# Altium schematic sheet RF.SchDoc
size A3
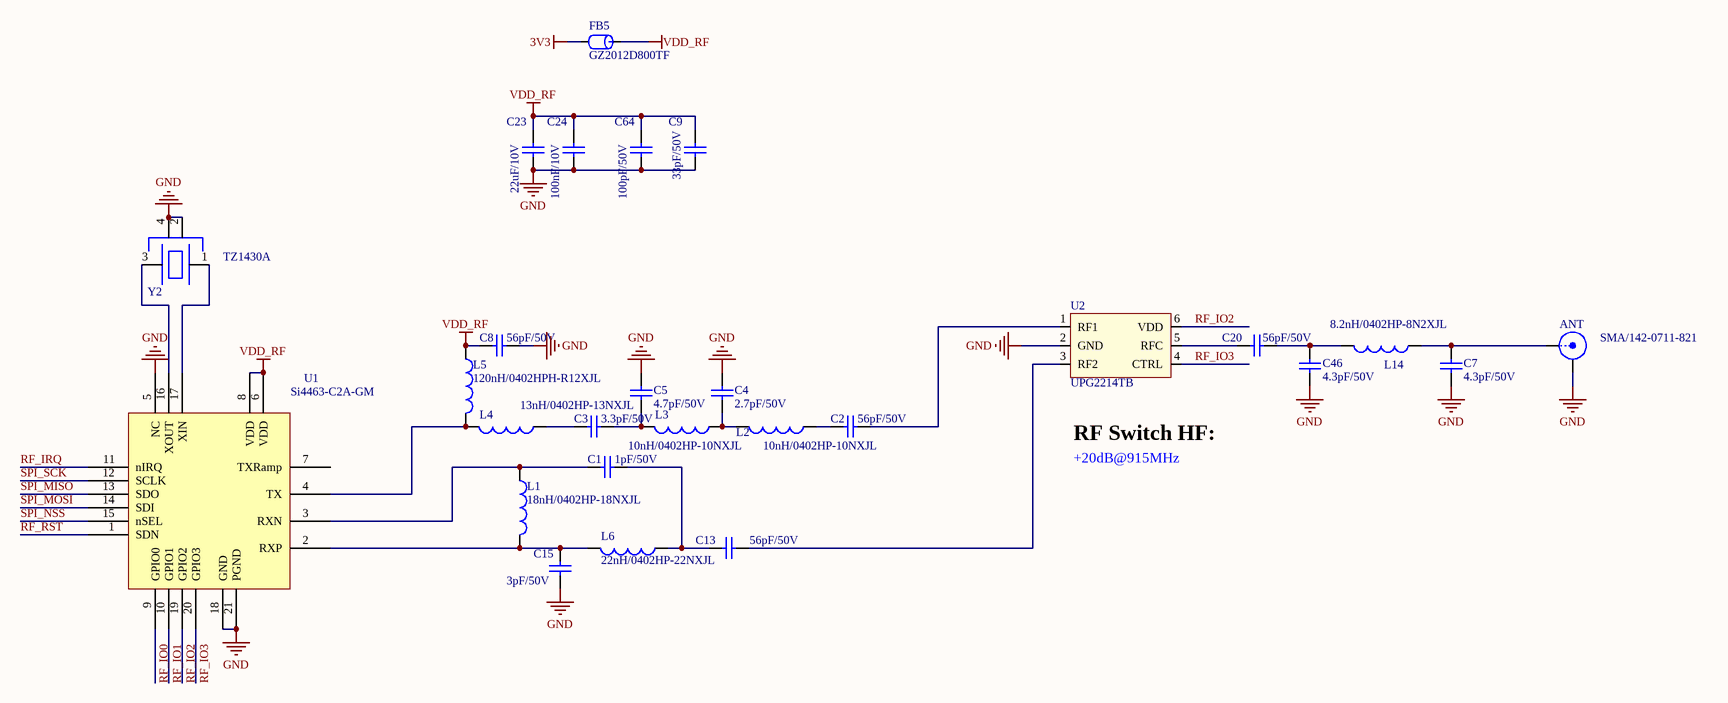
[diagram p0: RF.SchDoc]

## Parts
ANT  SMA/142-0711-821  [SMA END LAUNCH JACK RECEPTACLE SHORT]
C1  1pF/50V  [0402C]
C2  56pF/50V  [0402C]
C3  3.3pF/50V  [0402C]
C4  2.7pF/50V  [0402C]
C5  4.7pF/50V  [0402C]
C7  4.3pF/50V  [0402C]
C8  56pF/50V  [0402C]
C9  33pF/50V  [0603C]
C13  56pF/50V  [0402C]
C15  3pF/50V  [0402C]
C20  56pF/50V  [0402C]
C23  22uF/10V  [0805C]
C24  100nF/10V  [0603C]
C46  4.3pF/50V  [0402C]
C64  100pF/50V  [0603C]
FB5  GZ2012D800TF  [0805CZ]
L1  18nH/0402HP-18NXJL  [0402R]
L2  10nH/0402HP-10NXJL  [0402R]
L3  10nH/0402HP-10NXJL  [0402R]
L4  13nH/0402HP-13NXJL  [0402R]
L5  120nH/0402HPH-R12XJL  [0402R]
L6  22nH/0402HP-22NXJL  [0402R]
L14  8.2nH/0402HP-8N2XJL  [0402R]
U1  Si4463-C2A-GM  [QFN50P400X400X80-20N]
U2  UPG2214TB  [SC70-6]
Y2  TZ1430A  [OSCILLATOR-2.5X2.0]

## Nets
3V3: FB5.2
GND: ANT.2(GND) C4.2 C5.2 C7.1 C8.2 C9.1 C15.1 C23.1 C24.1 C46.1 C64.1 U1.5(NC) U1.18(GND) U1.21(PGND) U2.2(GND) Y2.2(GND) Y2.4(GND)
VDD_RF: C8.1 C9.2 C23.2 C24.2 C64.2 FB5.1 L5.1 U1.6(VDD) U1.8(VDD)
RF_IO0: U1.9(GPIO0)
RF_IO1: U1.10(GPIO1)
RF_IO2: U1.19(GPIO2) U2.6(VDD)
RF_IO3: U1.20(GPIO3) U2.4(CTRL)
RF_IRQ: U1.11(nIRQ)
RF_RST: U1.1(SDN)
SPI_MISO: U1.13(SDO)
SPI_MOSI: U1.14(SDI)
SPI_NSS: U1.15(nSEL)
SPI_SCK: U1.12(SCLK)
NetANT_1: ANT.1(Signal) C7.2 L14.1
NetC1_1: C1.1 L1.1 U1.3(RXN)
NetC1_2: C1.2 C13.1 L6.1
NetC2_1: C2.1 U2.1(RF1)
NetC2_2: C2.2 L2.1
NetC3_1: C3.1 L4.1
NetC3_2: C3.2 C5.1 L3.2
NetC4_1: C4.1 L2.2 L3.1
NetC13_2: C13.2 U2.3(RF2)
NetC15_2: C15.2 L1.2 L6.2 U1.2(RXP)
NetC20_1: C20.1 C46.2 L14.2
NetC20_2: C20.2 U2.5(RFC)
NetL4_2: L4.2 L5.2 U1.4(TX)
NetU1_16: U1.16(XOUT) Y2.3
NetU1_17: U1.17(XIN) Y2.1

Not connected (* = marked no-connect by the designer): U1 7(TXRamp)

## Notes on the sheet
- RF Switch HF:
- +20dB@915MHz

## Library data of the parts
ANT = SMA: SMA Straight Connector; LatestRevisionDate: 05-oct-2007  -  Semtech; LatestRevisionNote: Re-released for DXP Platform.; Publisher: Altium Limited
C1-C5 C8 C13 C15 C20 = Cap: Capacitor SMD; Value: 100nF; Published: 8-Jun-2000; LatestRevisionDate: 05-oct-2007  -  Semtech; LatestRevisionNote: Re-released for DXP Platform.; Publisher: Altium Limited
C7 C46 = Cap: Capacitor SMD; Value: NC; Published: 8-Jun-2000; LatestRevisionDate: 05-oct-2007  -  Semtech; LatestRevisionNote: Re-released for DXP Platform.; Publisher: Altium Limited
C9 C24 C64 = Cap Semi: Capacitor (Semiconductor SIM Model); Value: 1uF; Published: 8-Jun-2000; LatestRevisionDate: 05-oct-2007  -  Semtech; LatestRevisionNote: Re-released for DXP Platform.; Publisher: Altium Limited
C23 = Cap Semi: Capacitor (Semiconductor SIM Model); Value: 22uF; Published: 8-Jun-2000; LatestRevisionDate: 05-oct-2007  -  Semtech; LatestRevisionNote: Re-released for DXP Platform.; Publisher: Altium Limited
FB5 = FB: Part Field 1: 磁珠/0603/1K ohm/100MHz; FB: BLM18BD102SN1(muRata); Text Field1: FB
L1-L3 L5 L6 = Inductor: Inductor SMD; Code_IEC: 1005; Value: VAL?; Published: 8-Jun-2000; LatestRevisionDate: 05-oct-2007  -  Semtech; LatestRevisionNote: Re-released for DXP Platform.; Publisher: Altium Limited; Code_JEITA: 0402
L4 = Inductor: Inductor SMD; Code_IEC: 1005; Value: 870mA; Published: 8-Jun-2000; LatestRevisionDate: 05-oct-2007  -  Semtech; LatestRevisionNote: Re-released for DXP Platform.; Publisher: Altium Limited; Code_JEITA: 0402
L14 = Inductor: Inductor SMD; Code_IEC: 1005; Value: 0R; Published: 8-Jun-2000; LatestRevisionDate: 05-oct-2007  -  Semtech; LatestRevisionNote: Re-released for DXP Platform.; Publisher: Altium Limited; Code_JEITA: 0402
U1 = Si4463
U2 = PE4259 RF Switch: PE4259 Peregrine RF Switch; LatestRevisionDate: 03-Sep-2012 -  Semtech; Value: PE4259
Y2 = XTAL3